# EAGLE design Power Button (EAGLE 9.6.2)
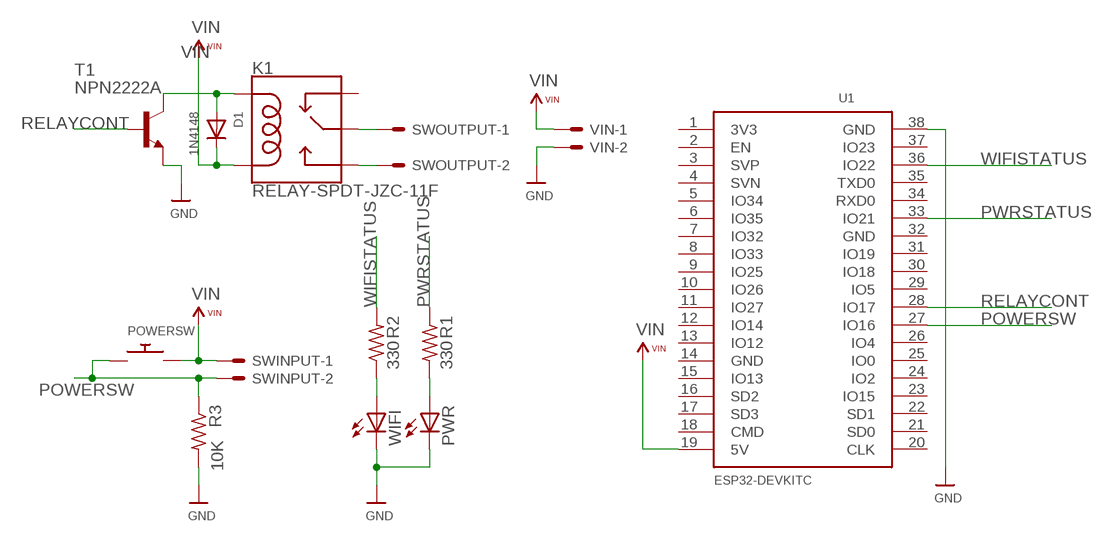
[diagram p0: schematic, sheet 1]

## Parts
D1  1N4148  DIODEDO-1N4148  [DO-1N4148]
K1  RELAY-SPDT-JZC-11F  [RELAY-JZC]
POWERSW  SWITCH_PUSHBUTTONEVQ-PE  [TACT_PANA-EVQ]
PWR  LEDCHIPLED_1206  [CHIPLED_1206]
R1  330  R-US_M1206  [M1206]
R2  330  R-US_M1206  [M1206]
R3  10K  R-US_M1206  [M1206]
SWINPUT  KK-156-2  [KK-156-2]
SWOUTPUT  KK-156-2  [KK-156-2]
T1  NPN2222A  2N5088  [TO92]
U1  ESP32DEVKITC  [ESP32-DEVKITC]
VIN  KK-156-2  [KK-156-2]
WIFI  LEDCHIPLED_1206  [CHIPLED_1206]

## Nets
GND: PWR.C R3.2 T1.3(E) U1.38(GND) VIN.2 WIFI.C
N$2: R2.1 WIFI.A
N$3: PWR.A R1.2
POWERSW: POWERSW.P$1 R3.1 SWINPUT.2 U1.27(IO16)
PWRSTATUS: R1.1 U1.33(IO21)
RELAY1: K1.4(MAIN) SWOUTPUT.1
RELAY2: K1.3(NO) SWOUTPUT.2
RELAYCONT: T1.2(B) U1.28(IO17)
RELAYSW: D1.A K1.5(COIL1) T1.1(C)
VIN: D1.C K1.1(COIL2) POWERSW.P$2 SWINPUT.1 U1.19(5V) VIN.1
WIFISTATUS: R2.2 U1.36(IO22)
Unconnected: K1.2(NC) U1.1(3V3) U1.2(EN) U1.3(SVP) U1.4(SVN) U1.5(IO34) U1.6(IO35) U1.7(IO32) U1.8(IO33) U1.9(IO25) U1.10(IO26) U1.11(IO27) U1.12(IO14) U1.13(IO12) U1.14(GND) U1.15(IO13) U1.16(SD2) U1.17(SD3) U1.18(CMD) U1.20(CLK) U1.21(SD0) U1.22(SD1) U1.23(IO15) U1.24(IO2) U1.25(IO0) U1.26(IO4) U1.29(IO5) U1.30(IO18) U1.31(IO19) U1.32(GND) U1.34(RXD0) U1.35(TXD0) U1.37(IO23)

## Library data of the parts
D1 = adafruit:DIODE: Diode SMADIODE - SMA Surface Mount Package 20V 1A Schottky Diode Digikey: 641-1014-6-ND DO-1N4148 - Through Hole Small Current Diode SOD-123 20V 1 A (.5mV Vf) Schottky Diode - Digikey: MBRX120TPMSCT-ND SOD-323 10V 570mA (.38mV Vf, 3ns) Schottky Diode - Digikey: ZLLS410CT-ND SOD-523 30V 30mA Schottky Diode (RB751S-40TE61) - Digikey: RB751S-40TE61CT-ND SOT23-R/W - SOT23 Package (R = Solder Paste/Reflow Ovens, W = Hand-Soldering) BAT54Film 40V 300mA - Digikey: 497-7162-1-ND
K1 = SparkFun-Electromechanical:RELAY-SPDT: SPDT Electromechanical Relay Single-pole, double-throw sealed relays. When current is applied to the coil, it throws a simple changeover switch, terminating the connection from the NC contact to ground and closing the NO contact. Use them to switch high voltage/high current devices. SparkFun Products JQX-15F: Relay SPDT Sealed - 20A <https://www.sparkfun.com/products/10924> (COM-10924) JZC-11F: Relay SPDT Sealed <https://www.sparkfun.com/products/100> (COM-00100); PROD_ID: COMP-09533; SF_SKU: COM-00100
POWERSW = adafruit:SWITCH_PUSHBUTTON: Buttons SOFTTOUCHSMD_SJ - Soft touch temporary push button (Super Junk Akihabara) Compatible with SKPMANE010 [Mouser: 688-SKPMAN] C&K_KSS = Digikey: KSS221GLFS
PWR WIFI = adafruit:LED: LED OSRAM: - CHIPLED LG R971, LG N971, LY N971, LG Q971, LY Q971, LO R971, LY R971 LH N974, LH R974 LS Q976, LO Q976, LY Q976 LO Q996 - Hyper CHIPLED LW Q18S LB Q993, LB Q99A, LB R99A - SideLED LS A670, LO A670, LY A670, LG A670, LP A670 LB A673, LV A673, LT A673, LW A673 LH A674 LY A675 LS A676, LA A676, LO A676, LY A676, LW A676 LS A679, LY A679, LG A679 - Hyper Micro SIDELED® LS Y876, LA Y876, LO Y876, LY Y876 LT Y87S - SmartLED LW L88C, LW L88S LB L89C, LB L89S, LG L890 LS L89K, LO L89K, LY L89K LS L896, LA L896, LO L896, LY L896 - TOPLED LS T670, LO T670, LY T670, LG T670, LP T670 LSG T670, LSP T670, LSY T670, LOP T670, LYG T670 LG T671, LOG T671, LSG T671 LB T673, LV T673, LT T673, LW T673 LH T674 LS T676, LA T676, LO T676, LY T676, LB T676, LH T676, LSB T676, LW T676 LB T67C, LV T67C, LT T67C, LS T67K, LO T67K, LY T67K, LW E67C LS E67B, LA E67B, LO E67B, LY E67B, LB E67C, LV E67C, LT E67C LW T67C LS T679, LY T679, LG T679 LS T770, LO T770, LY T770, LG T770, LP T770 LB T773, LV T773, LT T773, LW T773 LH T774 LS E675, LA E675, LY E675, LS T675 LS T776, LA T776, LO T776, LY T776, LB T776 LHGB T686 LT T68C, LB T68C - Hyper Mini TOPLED® LB M676 - Mini TOPLED Santana® LG M470 LS M47K, LO M47K, LY M47K Source: http://www.osram.convergy.de/
R1-R3 = BeagleBone_Black_Wireless:R-US_: RESISTOR, American symbol
SWINPUT SWOUTPUT VIN = con-molex:KK-156-2: KK 156 HEADER Source: http://www.molex.com/pdm_docs/sd/026604100_sd.pdf; MF: MOLEX; OC_FARNELL: unknown; OC_NEWARK: unknown
T1 = transistor:2N5088: NPN TRANSISTOR
U1 = ESP32-DEVKITC:ESP32DEVKITC

## Board
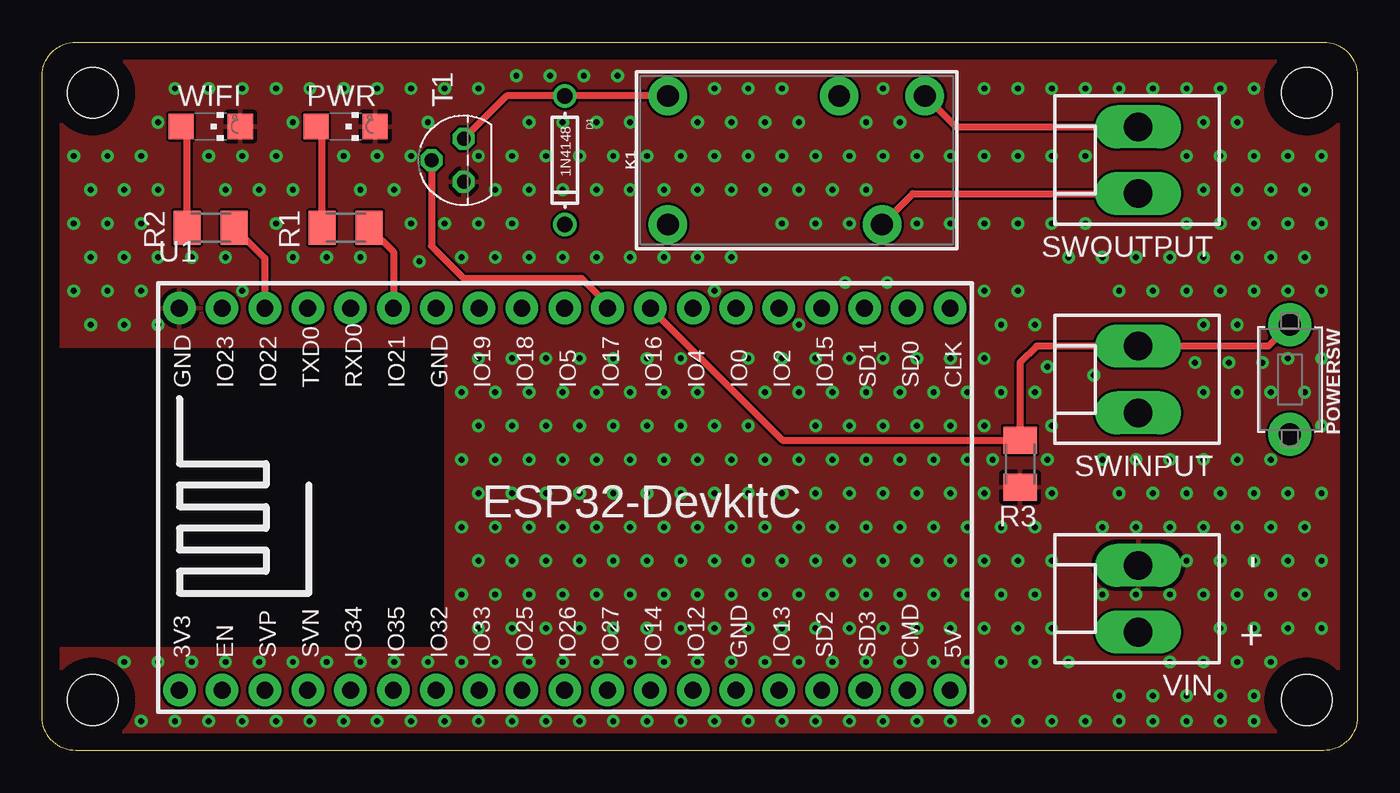
[diagram p1: board, top side]
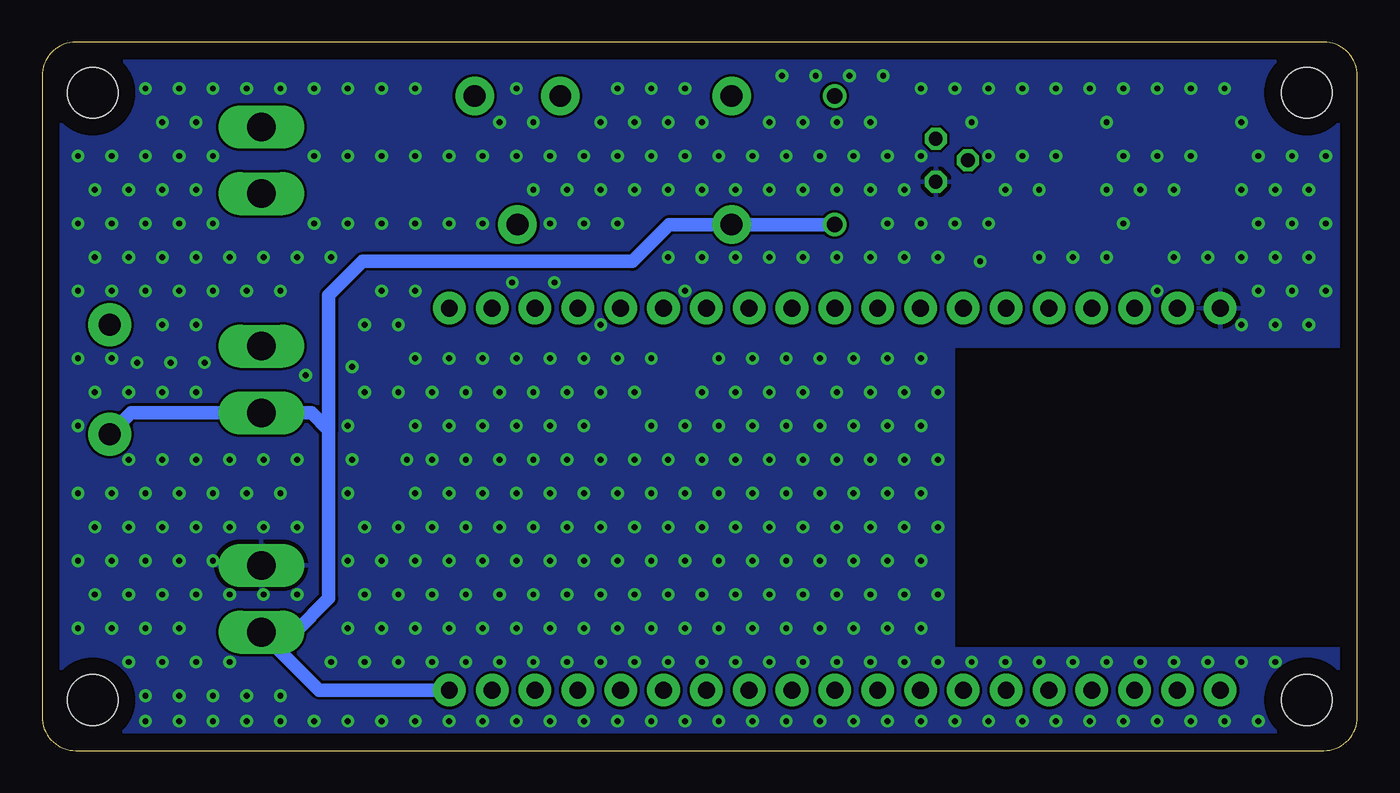
[diagram p2: board, bottom side, seen from below]

Size 78 x 42 mm. Coordinates in mm from the lower left corner, seen from the top.
Outline: 2,42 76,42 arc-90 78,40 78,2 arc-90 76,0 2,0 arc-90 0,2 0,40 arc-90 2,42
Copper layers (1*16): Top 0.035mm / dielectric 1.5mm / Bottom 0.035mm
Design rules "default": minimum track width 6mil, minimum drill 0.35mm, track to track 6mil, track to pad 6mil, pad to pad 6mil, via to via 6mil, smd to smd 6mil, copper to edge 40mil, drill to drill 6mil, minimum pad ring 10mil, minimum via ring 8mil, stop-mask expansion 4mil, vias tented up to drill 0.5mm, thermal gap 10mil
Holes 3 mm at 3,39 3,3 75,3 75,39

### Footprints (pad centres in the part's own frame; a part is rotated, then mirrored left to right if it is on the bottom)
DO-1N4148 = drill 0.9: A -3.81,0; C 3.81,0
RELAY-JZC = drill 1.3 pad 2.286: 1 3.81,-8.89; 2 -3.81,1.27; 3 -3.81,6.35; 4 3.81,3.81; 5 -3.81,-8.89
TACT_PANA-EVQ = drill 1.3 pad 2.54: P$1 -3.25,0; P$2 3.25,0
CHIPLED_1206 = smd 1.5 x 1.5: A 0,-1.75; C 0,1.75
M1206 = smd 1.6 x 2: 1 -1.4,0; 2 1.4,0
KK-156-2 = drill 1.7 pad 2.184 long: 1 -1.98,0; 2 1.98,0
TO92 = drill 0.813 octagon: 1 1.27,0; 2 0,1.905; 3 -1.27,0
ESP32-DEVKITC = drill 1 pad 1.93: 1 -22.87,-11.42; 2 -20.33,-11.42; 3 -17.79,-11.42; 4 -15.25,-11.42; 5 -12.71,-11.42; 6 -10.17,-11.42; 7 -7.63,-11.42; 8 -5.09,-11.42; 9 -2.55,-11.42; 10 -0.01,-11.42; 11 2.53,-11.42; 12 5.07,-11.42; 13 7.61,-11.42; 14 10.15,-11.42; 15 12.69,-11.42; 16 15.23,-11.42; 17 17.77,-11.42; 18 20.31,-11.42; 19 22.85,-11.42; 20 22.85,11.23; 21 20.31,11.23; 22 17.77,11.23; 23 15.23,11.23; 24 12.69,11.23; 25 10.15,11.23; 26 7.61,11.23; 27 5.07,11.23; 28 2.53,11.23; 29 -0.01,11.23; 30 -2.55,11.23; 31 -5.09,11.23; 32 -7.63,11.23; 33 -10.17,11.23; 34 -12.71,11.23; 35 -15.25,11.23; 36 -17.79,11.23; 37 -20.33,11.23; 38 -22.87,11.23

### Placement (x,y rotation side)
D1  31,35 270 top
K1  46,35 270 top
POWERSW  74,22 270 top
PWR  18,37 270 top
R1  18,31 180 top
R2  10,31 0 top
R3  58,17 270 top
SWINPUT  65,22 90 top
SWOUTPUT  65,35 90 top
T1  25,35 90 top
U1  31,15 0 top
VIN  65,9 90 top
WIFI  10,37 270 top

### Tracks (layer width: path | path; a pad name or v marks a point on that pad's centre or on a via)
GND  (via drill 0.35)
  other vias: 2.87,25.25 1.87,27.25 2.87,29.25 1.87,31.25 2.87,33.25 1.87,35.25 4.87,5.25 4.87,25.25 3.87,27.25 4.87,29.25 3.87,31.25 4.87,33.25 3.87,35.25 5.87,1.75 6.87,5.25 6.87,25.25 5.87,27.25 6.87,29.25 5.87,31.25 6.87,33.25 5.87,35.25 6.87,37.25 7.87,1.75 8.87,5.25 8.87,29.25 7.87,39.25 9.87,1.75 10.87,5.25 10.87,29.25 10.87,33.25 9.87,35.25 9.87,39.25 11.87,1.75 12.87,5.25 11.87,27.25 12.87,33.25 11.87,35.25 11.87,39.25 13.87,1.75 14.87,5.25 14.87,29.25 13.87,31.25 14.87,33.25 13.87,35.25 14.87,37.25 13.87,39.25 15.87,1.75 16.87,5.25 16.87,29.25 15.87,39.25 17.87,1.75 18.87,5.25 18.87,29.25 18.87,33.25 17.87,35.25 17.87,39.25 19.87,1.75 20.87,5.25 20.87,33.25 19.87,35.25 19.87,39.25 21.87,1.75 22.87,5.25 22.37,29 21.87,31.25 21.87,35.25 22.87,37.25 21.87,39.25 23.87,1.75 24.87,5.25 24.87,9.25 24.87,13.25 24.87,17.25 24.87,21.25 24.87,29.25 23.87,31.25 23.87,39.25 25.87,1.75 26.87,5.25 25.87,7.25 26.87,9.25 25.87,11.25 26.87,13.25 25.87,15.25 26.87,17.25 25.87,19.25 26.87,21.25 25.87,23.25 26.87,29.25 25.87,31.25 26.87,33.25 25.87,35.25 25.87,39.25 27.87,1.75 28.87,5.25 27.87,7.25 28.87,9.25 27.87,11.25 28.87,13.25 27.87,15.25 28.87,17.25 27.87,19.25 28.87,21.25 27.87,23.25 28.87,29.25 27.87,31.25 28.87,33.25 27.87,35.25 28.87,37.25 28.12,40 29.87,1.75 30.87,5.25 29.87,7.25 30.87,9.25 29.87,11.25 30.87,13.25 29.87,15.25 30.87,17.25 29.87,19.25 30.87,21.25 29.87,23.25 30.87,29.25 30.87,33.25 29.87,35.25 30.87,37.25 30.12,40 31.87,1.75 32.87,5.25 31.87,7.25 32.87,9.25 31.87,11.25 32.87,13.25 31.87,15.25 32.87,17.25 31.87,19.25 32.87,21.25 31.87,23.25 32.87,29.25 32.87,33.25 31.87,35.25 32.87,37.25 32.12,40 33.87,1.75 34.87,5.25 33.87,7.25 34.87,9.25 33.87,11.25 34.87,13.25 33.87,15.25 34.87,17.25 33.87,19.25 34.87,21.25 33.87,23.25 34.87,29.25 34.87,33.25 33.87,35.25 34.87,37.25 34.12,40 35.87,1.75 36.87,5.25 35.87,7.25 36.87,9.25 35.87,11.25 36.87,13.25 35.87,15.25 36.87,17.25 35.87,19.25 36.87,21.25 35.87,23.25 36.87,29.25 36.87,33.25 35.87,35.25 37.87,1.75 38.87,5.25 37.87,7.25 38.87,9.25 37.87,11.25 38.87,13.25 37.87,15.25 38.87,17.25 37.87,19.25 38.87,21.25 37.87,23.25 38.87,29.25 38.87,33.25 37.87,35.25 38.87,37.25 39.87,1.75 40.87,5.25 39.87,7.25 40.87,9.25 39.87,11.25 40.87,13.25 39.87,15.25 40.87,17.25 39.87,19.25 39.87,27.25 40.87,29.25 40.87,33.25 39.87,35.25 40.87,37.25 39.87,39.25 41.87,1.75 42.87,5.25 41.87,7.25 42.87,9.25 41.87,11.25 42.87,13.25 41.87,15.25 42.87,17.25 41.87,19.25 42.87,21.25 41.87,23.25 42.87,33.25 41.87,35.25 42.87,37.25 41.87,39.25 43.87,1.75 44.87,5.25 43.87,7.25 44.87,9.25 43.87,11.25 44.87,13.25 43.87,15.25 44.87,17.25 44.87,21.25 43.87,23.25 44.87,25.25 43.87,31.25 44.87,33.25 43.87,35.25 44.87,37.25 43.87,39.25 45.87,1.75 46.87,5.25 45.87,7.25 46.87,9.25 45.87,11.25 46.87,13.25 45.87,15.25 46.87,17.25 45.87,19.25 46.87,21.25 45.87,23.25 45.87,31.25 46.87,33.25 45.87,35.25 47.87,1.75 48.87,5.25 47.87,7.25 48.87,9.25 47.87,11.25 48.87,13.25 47.87,15.25 48.87,17.25 47.87,19.25 48.87,21.25 47.87,23.25 47.62,27.75 47.87,31.25 48.87,33.25 47.87,35.25 48.87,37.25 49.87,1.75 50.87,5.25 49.87,7.25 50.87,9.25 49.87,11.25 50.87,13.25 49.87,15.25 50.87,17.25 49.87,19.25 50.87,21.25 49.87,23.25 50.12,27.75 49.87,35.25 50.87,37.25 49.87,39.25 51.87,1.75 52.87,5.25 51.87,7.25 52.87,9.25 51.87,11.25 52.87,13.25 51.87,15.25 52.87,17.25 51.87,19.25 52.87,21.25 51.87,23.25 51.87,31.25 51.87,35.25 53.87,1.75 54.87,5.25 53.87,7.25 54.87,9.25 53.87,11.25 54.87,13.25 53.87,15.25 54.87,17.25 53.87,19.25 54.87,21.25 53.87,23.25 53.87,31.25 53.87,35.25 55.87,1.75 56.87,5.25 55.87,7.25 56.87,9.25 55.87,11.25 56.87,13.25 55.87,15.25 56.37,17.25 55.87,19.25 56.87,21.25 55.87,23.25 56.87,25.25 55.87,27.25 55.87,31.25 55.87,35.25 55.87,39.25 57.87,1.75 58.87,5.25 57.87,7.25 58.87,9.25 57.87,11.25 58.87,13.25 59.62,17.25 58.87,21.25 58.87,25.25 57.87,27.25 57.87,31.25 57.87,35.25 57.87,39.25 59.87,1.75 60.87,5.25 59.87,7.25 59.87,11.25 59.87,15.25 59.87,19.25 59.62,22.75 60.87,29.25 59.87,31.25 59.87,35.25 59.87,39.25 61.87,1.75 62.87,9.25 62.87,13.25 62.87,17.25 62.37,22.25 62.87,29.25 61.87,31.25 61.87,35.25 61.87,39.25 63.87,1.75 63.87,3.25 64.87,9.25 64.87,13.25 63.87,15.25 64.87,17.25 63.87,27.25 64.87,29.25 63.87,39.25 65.87,1.75 65.87,3.25 66.87,5.25 66.87,9.25 66.87,13.25 65.87,15.25 66.87,17.25 65.87,27.25 66.87,29.25 65.87,39.25 67.87,1.75 67.87,3.25 68.87,5.25 68.87,9.25 67.87,11.25 68.87,13.25 67.87,15.25 68.87,17.25 68.87,21.25 68.37,23 68.87,25.25 67.87,27.25 68.87,29.25 67.87,31.25 68.87,33.25 67.87,35.25 68.87,37.25 67.87,39.25 69.87,1.75 69.87,3.25 70.87,5.25 69.87,7.25 70.87,9.25 69.87,11.25 70.87,13.25 69.87,15.25 70.87,17.25 70.87,21.25 70.37,23 70.87,25.25 69.87,27.25 70.87,29.25 69.87,31.25 70.87,33.25 69.87,35.25 70.87,37.25 69.87,39.25 71.87,1.75 71.87,3.25 72.87,5.25 71.87,7.25 72.87,9.25 71.87,11.25 72.87,13.25 71.87,15.25 72.87,17.25 72.87,21.25 72.37,23 71.87,27.25 72.87,29.25 71.87,31.25 72.87,33.25 71.87,35.25 71.87,39.25 73.87,7.25 74.87,9.25 73.87,11.25 74.87,13.25 73.87,15.25 74.87,21.25 73.87,23.25 73.87,27.25 74.87,29.25 73.87,31.25 74.87,33.25 73.87,35.25 75.87,7.25 75.87,11.25 75.87,15.25 75.87,19.25 75.87,23.25 75.87,27.25 75.87,31.25 75.87,35.25
  pour Top: 0,0 78,0 78,42 0,42 0,24 24,24 24,6 0,6
  pour Bottom: 0,0 78,0 78,42 0,42 0,24 24,24 24,6 0,6
N$2
  Top 0.406: R2.1 8.6,36.65 WIFI.A
N$3
  Top 0.406: R1.2 16.6,36.65 PWR.A
POWERSW
  Top 0.406: POWERSW.P$1 72.73,23.98 SWINPUT.2 58.98,23.98 58,23 R3.1 43.9,18.4 U1.27
PWRSTATUS
  Top 0.406: R1.1 20.83,29.57 U1.33
RELAY1
  Top 0.406: K1.4 51.64,33.02 SWOUTPUT.1
RELAY2
  Top 0.406: K1.3 54.18,36.98 SWOUTPUT.2
RELAYCONT
  Top 0.406: T1.2 23.09,29.91 25,28 32,28 33.53,26.47 U1.28
RELAYSW
  Top 0.406: K1.5 D1.A 27.54,38.81 T1.1
VIN
  Bottom 0.813: 61,19 62.02,20.02 SWINPUT.1 72.73,20.02 POWERSW.P$2 | 61,19 61,27 59,29 43,29 40.81,31.19 K1.1 D1.C | U1.19 61.56,3.58 VIN.1 63,7.02 61,9.02 61,19
WIFISTATUS
  Top 0.406: R2.2 13.21,29.19 U1.36

### Text on the board
tNames: - | +